# Altium project JLB_PCB.PrjPcb (part 2 of 2)

## Sheet Display.SchDoc
size A3; SheetNumber: 16; SheetTotal: 18
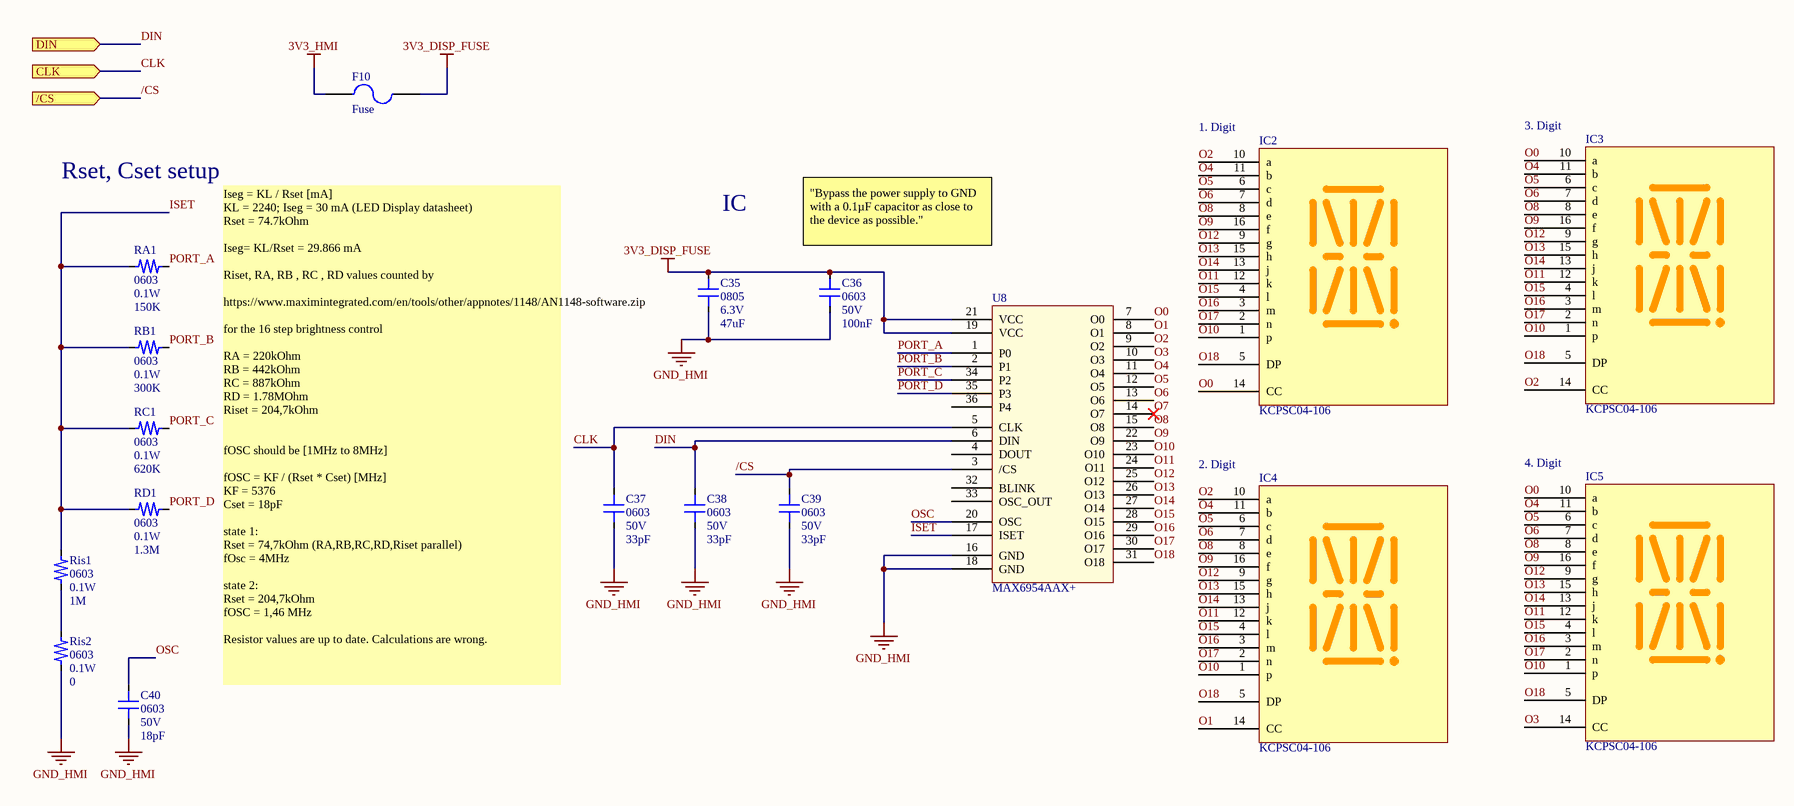
[diagram p15: Display.SchDoc]

### Parts
C35  0805  value 47uF  Rating: 6.3V  [C_0805]
C36  0603  value 100nF  Rating: 50V  [C_0603]
C37  0603  value 33pF  Rating: 50V  [C_0603]
C38  0603  value 33pF  Rating: 50V  [C_0603]
C39  0603  value 33pF  Rating: 50V  [C_0603]
C40  0603  value 18pF  Rating: 50V  [C_0603]
F10  Fuse  [F_0603]
IC2  KCPSC04-106  [KCPSC04-106]
IC3  KCPSC04-106  [KCPSC04-106]
IC4  KCPSC04-106  [KCPSC04-106]
IC5  KCPSC04-106  [KCPSC04-106]
RA1  0603  value 150K  Rating: 0.1W  [R_0603]
RB1  0603  value 300K  Rating: 0.1W  [R_0603]
RC1  0603  value 620K  Rating: 0.1W  [R_0603]
RD1  0603  value 1.3M  Rating: 0.1W  [R_0603]
Ris1  0603  value 1M  Rating: 0.1W  [R_0603]
Ris2  0603  value 0  Rating: 0.1W  [R_0603]
U8  MAX6954AAX+  [TSSOP-36]

### Ports
/CS (in), CLK (in), DIN (in)

### Nets
3V3_DISP_FUSE: C35.2(C2) C36.2(C2) F10.2 U8.19(VCC) U8.21(VCC)
3V3_HMI: F10.1
GND_HMI: C35.1(C1) C36.1(C1) C37.1(C1) C38.1(C1) C39.1(C1) C40.1(C1) Ris2.1(R1) U8.16(GND) U8.18(GND)
/CS: C39.2(C2) U8.3(/CS) ; port /CS
CLK: C37.2(C2) U8.5(CLK) ; port CLK
DIN: C38.2(C2) U8.6(DIN) ; port DIN
ISET: RA1.2(R2) RB1.2(R2) RC1.2(R2) RD1.2(R2) Ris1.2(R2) U8.17(ISET)
O0: IC2.14(CC) IC3.10(a) IC5.10(a) U8.7(O0)
O1: IC4.14(CC) U8.8(O1)
O2: IC2.10(a) IC3.14(CC) IC4.10(a) U8.9(O2)
O3: IC5.14(CC) U8.10(O3)
O4: IC2.11(b) IC3.11(b) IC4.11(b) IC5.11(b) U8.11(O4)
O5: IC2.6(c) IC3.6(c) IC4.6(c) IC5.6(c) U8.12(O5)
O6: IC2.7(d) IC3.7(d) IC4.7(d) IC5.7(d) U8.13(O6)
O7: U8.14(O7)
O8: IC2.8(e) IC3.8(e) IC4.8(e) IC5.8(e) U8.15(O8)
O9: IC2.16(f) IC3.16(f) IC4.16(f) IC5.16(f) U8.22(O9)
O10: IC2.1(p) IC3.1(p) IC4.1(p) IC5.1(p) U8.23(O10)
O11: IC2.12(k) IC3.12(k) IC4.12(k) IC5.12(k) U8.24(O11)
O12: IC2.9(g) IC3.9(g) IC4.9(g) IC5.9(g) U8.25(O12)
O13: IC2.15(h) IC3.15(h) IC4.15(h) IC5.15(h) U8.26(O13)
O14: IC2.13(j) IC3.13(j) IC4.13(j) IC5.13(j) U8.27(O14)
O15: IC2.4(l) IC3.4(l) IC4.4(l) IC5.4(l) U8.28(O15)
O16: IC2.3(m) IC3.3(m) IC4.3(m) IC5.3(m) U8.29(O16)
O17: IC2.2(n) IC3.2(n) IC4.2(n) IC5.2(n) U8.30(O17)
O18: IC2.5(DP) IC3.5(DP) IC4.5(DP) IC5.5(DP) U8.31(O18)
OSC: C40.2(C2) U8.20(OSC)
PORT_A: RA1.1(R1) U8.1(P0)
PORT_B: RB1.1(R1) U8.2(P1)
PORT_C: RC1.1(R1) U8.34(P2)
PORT_D: RD1.1(R1) U8.35(P3)
NetRis1_1: Ris1.1(R1) Ris2.2(R2)

Not connected (* = marked no-connect by the designer): U8 4(DOUT) 32(BLINK) 33(OSC_OUT) 36(P4)

### Notes on the sheet
- (near IC2) 1. Digit
- (near IC3) 3. Digit
- Rset, Cset setup
- IC
- (near C36) "Bypass the power supply to GND with a 0.1µF capacitor as close to the device as possible."
- (near IC4) 2. Digit
- (near IC5) 4. Digit
- Iseg = KL / Rset [mA]
  KL = 2240; Iseg = 30 mA (LED Display datasheet)
  Rset = 74.7kOhm
  Iseg= KL/Rset = 29.866 mA
  Riset, RA, RB , RC , RD values counted by
  https://www.maximintegrated.com/en/tools/other/appnotes/1148/AN1148-software.zip
  for the 16 step brightness control
  RA = 220kOhm
  RB = 442kOhm
  RC = 887kOhm
  RD = 1.78MOhm
  Riset = 204,7kOhm
  fOSC should be [1MHz to 8MHz]
  fOSC = KF / (Rset * Cset) [MHz]
  KF = 5376
  Cset = 18pF
  state 1:
  Rset = 74,7kOhm (RA,RB,RC,RD,Riset parallel)
  fOsc = 4MHz
  state 2:
  Rset = 204,7kOhm
  fOSC = 1,46 MHz
  Resistor values are up to date. Calculations are wrong.

### Library data of the parts
C35 = Cap_0805_47uF_6.3V_Chip: Part Number: CL21A476MQYNNNE; Type: Chip Capacitor; Tolerance: 20%; Order Number: 82-08-66; Distributor: Lomex; Link: http://lomex.hu/hu/webshop/#/page,0/search,82-08-66/stype,1/sidx,1; Price (HUF): 2.00; Package: 0805; ID: Cap_0805_47uF_6.3V_Chip; NI Part Number: -; NI PEN/DEB: -
C36 = Cap_0603_100nF_50V_Chip: Part Number: CC0603KRX7R9BB104; NI Part Number: 716340-01; Type: Chip Capacitor; Tolerance: 10%; NI PEN/DEB: DEB; Order Number: 82-06-23; Distributor: Lomex; Link: http://lomex.hu/hu/webshop/#/page,0/search,82-06-23/stype,1/sidx,1; Price (HUF): 2.00; Package: 0603; ID: Cap_0603_100nF_50V_Chip
C37-C39 = Cap_0603_33pF_50V_Chip: Part Number: CL10C330JB8NNNC; NI Part Number: 715511-01; Type: Chip Capacitor; Tolerance: 5%; NI PEN/DEB: DEB; Order Number: 82-09-74; Distributor: Lomex; Link: http://lomex.hu/hu/webshop/#/page,0/search,82-09-74/stype,1/sidx,1; Price (HUF): 2.00; Package: 0603; ID: Cap_0603_33pF_50V_Chip
C40 = Cap_0603_18pF_50V_Chip: Part Number: CL10C180JB8NNNC; NI Part Number: 715742-01; Type: Chip Capacitor; Tolerance: 5%; NI PEN/DEB: DEB; Order Number: 82-06-54; Distributor: Lomex; Link: http://lomex.hu/hu/webshop/#/page,0/search,82-06-54/stype,1/sidx,1; Price (HUF): 2.00; Package: 0603; ID: Cap_0603_18pF_50V_Chip
F10 = Oth_0438001.WR_F_0603: NI part number: 766308-01; Order number: 2413034; Rating: 32VDC; Type: Very Fast Acting Fuse; Value: 1A; NI PEN/DEB: DEB; Distributor: Farnell; ID: Oth_0438001.WR_F_0603; Link: http://hu.farnell.com/littelfuse/0438001-wr/fuse-smd-1a-0603-fast-acting-full/dp/2413034?ost=0438001.WR&selectedCategoryId=&categoryNameResp=%25C3%2596sszes%2Bkateg%25C3%25B3ria&searchView=table&iscrfnonsku=false; Package: F_0603; Part Number: 0438001.WR; Price (HUF): 142
IC2-IC5 = 14SegmentDisplaySingle: Distributor: Farnell; Link: http://hu.farnell.com/kingbright/kcpsc04-106/led-alpha-num-10-16mm-orange/dp/2449716; Type: 14SegmentDisplaySingle
RA1 RB1 RC1 RD1 = Res_0603_220K_0.1W_Chip: Part Number: CR-03FL7--220K; NI part number: 612705-01; Tolerance: 1%; NI PEN/DEB: DEB; Type: Chip Resistor; Order Number: 80-11-75; Distributor: Lomex; Price (HUF): 0.80; Package: 0603; ID: Res_0603_220K_0.1W_Chip
  RA1: Link: http://lomex.hu/hu/webshop/#/page,0/search,80-11-75/stype,1/sidx,1
  RB1: Link: http://lomex.hu/hu/webshop/#/search,80-45-26/stype,1
  RC1: Link: http://lomex.hu/hu/webshop/#/search,80-45-61/stype,1
  RD1: Link: http://lomex.hu/hu/webshop/#/search,80-49-35/stype,1
Ris1 = Res_0603_4K70_0.1W_Chip: Part Number: CR-03FL7---4K7; NI part number: 713782-01; Tolerance: 1%; NI PEN/DEB: PEN; Type: Chip Resistor; Order Number: 80-11-85; Distributor: Lomex; Link: http://lomex.hu/hu/webshop/#/page,0/search,80-11-85/stype,1/sidx,1; Price (HUF): 0.80; Package: 0603; ID: Res_0603_4K70_0.1W_Chip
Ris2 = Res_0603_200K_0.1W_Chip: Part Number: CR-03FL7--200K; NI part number: 713614-01; Tolerance: 1%; NI PEN/DEB: PEN; Type: Chip Resistor; Order Number: 80-13-51; Distributor: Lomex; Link: http://lomex.hu/hu/webshop/#/page,0/search,80-13-51/stype,1/sidx,1; Price (HUF): 0.80; Package: 0603; ID: Res_0603_200K_0.1W_Chip
U8 = IC_MAX6954AAX+_TSSOP-36: 16 Segment LED Driver; Order number: 2113136; Distributor: Farnell; Link: http://hu.farnell.com/maxim-integrated-products/max6954aax/driver-led-16x7seg-8x16seg-128/dp/2113136; Value: *; ID: IC_MAX6954AAX+_TSSOP-36; Note: MAX6954; Package: TSSOP-36; Part Number: MAX6954AAX+; Price (HUF): 7470; Type: 16 Segment LED Driver; NI part number: -; NI PEN/DEB: -

## Sheet Measurements.SchDoc
size A4; SheetNumber: 17; SheetTotal: 18
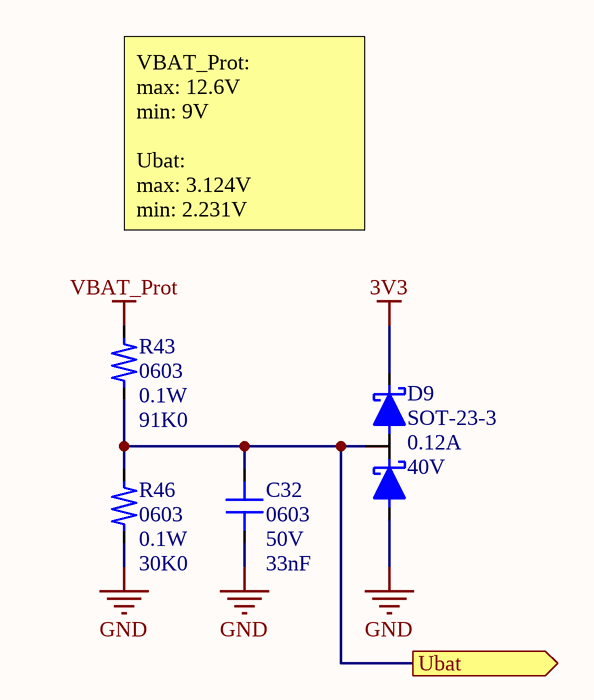
[diagram p16: Measurements.SchDoc]

### Parts
C32  0603  value 33nF  Rating: 50V  [C_0603]
D9  SOT-23-3  value 40V  Rating: 0.12A  [SOT-23-3]
R43  0603  value 91K0  Rating: 0.1W  [R_0603]
R46  0603  value 30K0  Rating: 0.1W  [R_0603]

### Ports
Ubat (out)

### Nets
3V3: D9.2(DC)
GND: C32.1(C1) D9.1(DA) R46.1(R1)
VBAT_Prot: R43.2(R2)
LV_BATT: C32.2(C2) D9.3(DCA) R43.1(R1) R46.2(R2) ; port Ubat

### Notes on the sheet
- VBAT_Prot:
  max: 12.6V
  min: 9V
  Ubat:
  max: 3.124V
  min: 2.231V

### Library data of the parts
C32 = CL10B333KB8NNNC: NI Part Number: 716045-01; Type: Chip Capacitor; Tolerance: 10%; ID: Cap_0603_33nF_50V_Chip; NI PEN/DEB: DEB; Part Number: CL10B333KB8NNNC; Order Number: 82-09-36; Distributor: Lomex; Link: http://lomex.hu/hu/webshop/#/page,0/search,82-09-36/stype,1/sidx,1; Price (HUF): 2.00; Package: 0603
D9 = Dio_SOT-23-3_40V_0.12A_Schottky_Series: Part Number: BAS40-04; Type: Schottky Dual Diode; Distributor: Lomex; Link: http://lomex.hu/hu/webshop/#/page,0/search,83-02-49/stype,1/sidx,1; Order Number: 83-02-49; Package: SOT-23-3; Price (HUF): 8; ID: Dio_SOT-23-3_40V_0.12A_Schottky_Series; NI part number: -; NI PEN/DEB: -
R43 = CR-03FL7---91K: NI part number: 612775-01; Tolerance: 1%; Note: NI: 90.9k; ID: Res_0603_91K0_0.1W_Chip; NI PEN/DEB: PEN; Type: Chip Resistor; Part Number: CR-03FL7---91K; Order Number: 80-14-58; Distributor: Lomex; Link: http://lomex.hu/hu/webshop/#/page,0/search,80-14-58/stype,1/sidx,1; Price (HUF): 0.80; Package: 0603
R46 = CR-03FL7---30K: NI part number: 612699-01; Tolerance: 1%; Note: NI: not in stock; ID: Res_0603_30K0_0.1W_Chip; NI PEN/DEB: DEB; Type: Chip Resistor; Part Number: CR-03FL7---30K; Order Number: 80-14-53; Distributor: Lomex; Link: http://lomex.hu/hu/webshop/#/page,0/search,80-14-53/stype,1/sidx,1; Price (HUF): 0.80; Package: 0603

## Sheet Enable_Signals.SchDoc
size A4; SheetNumber: 18; SheetTotal: 18
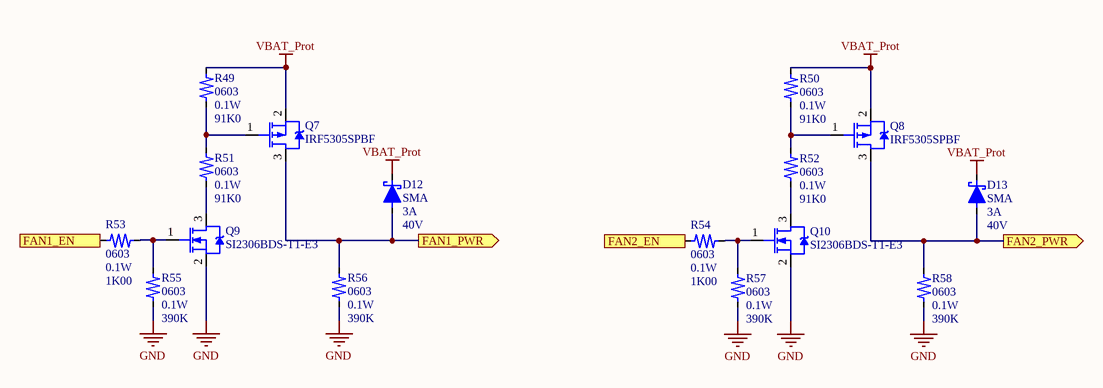
[diagram p17: Enable_Signals.SchDoc]

### Parts
D12  SMA  value 40V  Rating: 3A  [SMA]
D13  SMA  value 40V  Rating: 3A  [SMA]
Q7  IRF5305SPBF  [D2PAK-2]
Q8  IRF5305SPBF  [D2PAK-2]
Q9  SI2306BDS-T1-E3  [SOT-23-3]
Q10  SI2306BDS-T1-E3  [SOT-23-3]
R49  0603  value 91K0  Rating: 0.1W  [R_0603]
R50  0603  value 91K0  Rating: 0.1W  [R_0603]
R51  0603  value 91K0  Rating: 0.1W  [R_0603]
R52  0603  value 91K0  Rating: 0.1W  [R_0603]
R53  0603  value 1K00  Rating: 0.1W  [R_0603]
R54  0603  value 1K00  Rating: 0.1W  [R_0603]
R55  0603  value 390K  Rating: 0.1W  [R_0603]
R56  0603  value 390K  Rating: 0.1W  [R_0603]
R57  0603  value 390K  Rating: 0.1W  [R_0603]
R58  0603  value 390K  Rating: 0.1W  [R_0603]

### Ports
FAN1_EN (in), FAN1_PWR (out), FAN2_EN (in), FAN2_PWR (out)

### Nets
GND: Q9.2(S) Q10.2(S) R55.1(R1) R56.1(R1) R57.1(R1) R58.1(R1)
VBAT_Prot: D12.1(DC) D13.1(DC) Q7.2(S) Q8.2(S) R49.2(R2) R50.2(R2)
FAN1: R53.1(R1) ; port FAN1_EN
FAN1_PWR: D12.2(DA) Q7.3(D) R56.2(R2) ; port FAN1_PWR
FAN2: R54.1(R1) ; port FAN2_EN
FAN2_PWR: D13.2(DA) Q8.3(D) R58.2(R2) ; port FAN2_PWR
NetQ7_1: Q7.1(G) R49.1(R1) R51.2(R2)
NetQ8_1: Q8.1(G) R50.1(R1) R52.2(R2)
NetQ9_1: Q9.1(G) R53.2(R2) R55.2(R2)
NetQ9_3: Q9.3(D) R51.1(R1)
NetQ10_1: Q10.1(G) R54.2(R2) R57.2(R2)
NetQ10_3: Q10.3(D) R52.1(R1)

### Library data of the parts
D12 D13 = SS34A: Part Number: SS34A; Type: Schottky Diode; ID: Dio_SMA_40V_3A_Schottky; Distributor: Lomex; Link: http://lomex.hu/hu/webshop/#/page,0/search,83-02-56/stype,1/sidx,1; Order Number: 83-02-56; Package: SMA; Price (HUF): 19; NI part number: -; NI PEN/DEB: -
Q7 Q8 = IRF5305SPBF: P-Channel Power MOSFET; ID: Tra_D2PAK-2_55V_31A_P-FET; Rating: 31A; Type: P-FET; Value: 55V; Distributor: Lomex; Link: http://lomex.hu/hu/webshop/#/page,0/stype,1/sidx,10/instock,0/search,86-02-47; Order number: 86-02-47; Package: D2PAK-2; Part Number: IRF5305SPBF; Price (HUF): 230; NI part number: -; NI PEN/DEB: -
Q9 Q10 = SI2306BDS-T1-E3: N-Channel Power MOSFET; ID: Tra_SOT-23-3_30V_4A_N-FET; Rating: 4A; Type: N-FET; Value: 30V; Distributor: Lomex; Link: http://lomex.hu/hu/webshop/#/page,0/stype,1/sidx,10/instock,0/search,86-01-57; Order number: 86-01-57; Package: SOT-23-3; Part Number: SI2306BDS-T1-E3; Price (HUF): 83; NI part number: -; NI PEN/DEB: -
R49-R52 = CR-03FL7---91K: as R43 on sheet Measurements; Type: Chip Resistor; Part Number: CR-03FL7---91K; Order Number: 80-14-58; Distributor: Lomex; Link: http://lomex.hu/hu/webshop/#/page,0/search,80-14-58/stype,1/sidx,1; Price (HUF): 0.80; Package: 0603
R53 R54 = CR-03FL7----1K: NI part number: 713776-01; Tolerance: 1%; ID: Res_0603_1K00_0.1W_Chip; NI PEN/DEB: DEB; Type: Chip Resistor; Part Number: CR-03FL7----1K; Order Number: 80-11-59; Distributor: Lomex; Link: http://lomex.hu/hu/webshop/#/page,0/search,80-11-59/stype,1/sidx,1; Price (HUF): 0.80; Package: 0603
R55-R58 = CR-03FL7--390K: Tolerance: 1%; ID: Res_0603_390K_0.1W_Chip; Type: Chip Resistor; Part Number: CR-03FL7--390K; Order Number: 80-13-26; Distributor: Lomex; Link: http://lomex.hu/hu/webshop/#/page,0/search,80-13-26/stype,1/sidx,1; Price (HUF): 0.80; Package: 0603; NI part number: -; NI PEN/DEB: -

## Nets that join several sheets
3V3: MainSheet (J16.10), 3V3_Supply (F4.2), IMU (F5.1), Telemetry_Modul (F6.1), Measurements (D9.2)
3V3_HMI: HMI (J17.10), HMI_LEDs (5 pins), HMI_Buttons (8 pins), Display (F10.1)
5V: MainSheet (10 pins), MCU (F1.1), 5V_Supply (D3.1 F3.2), 3V3_Supply (C9.2 C10.2 IC1.3), Radio_module (F7.1)
8V4_F: MainSheet (J3.1), Front_Servo_Supply (D5.1 F8.2)
8V4_R: MainSheet (J6.1), Rear_Servo_Supply (D7.1 F9.2)
GND: MainSheet (22 pins), MCU (15 pins), Supply_Protection (D2.2 R1.1), 5V_Supply (13 pins), 3V3_Supply (5 pins), Front_Servo_Supply (13 pins), Rear_Servo_Supply (13 pins), IMU (U3.13), Telemetry_Modul (U4.10), Radio_module (U5.1), Measurements (C32.1 D9.1 R46.1), Enable_Signals (6 pins)
GND_HMI: HMI (J17.1), HMI_LEDs (10 pins), HMI_Buttons (10 pins), Display (9 pins)
VBAT: MainSheet (J4.1), Supply_Protection (SW1.1)
VBAT_Prot: Supply_Protection (D2.1 F2.2), 5V_Supply (5 pins), Front_Servo_Supply (5 pins), Rear_Servo_Supply (5 pins), Measurements (R43.2), Enable_Signals (6 pins)
ILEF: MainSheet (J8.9), MCU (U1.57)
ILER: MainSheet (J9.9), MCU (U1.63)
/CS: HMI (J17.8), Display (C39.2 U8.3)
AD_MISO: MainSheet (J8.4 J9.4), MCU (U1.85)
AD_MOSI: MainSheet (J8.3 J9.3), MCU (U1.125)
AD_SCK: MainSheet (J8.13 J9.13), MCU (U1.83)
ADCF1: MainSheet (J8.14), MCU (U1.82)
ADCF2: MainSheet (J8.15), MCU (U1.69)
ADCF3: MainSheet (J8.1), MCU (U1.137)
ADCF4: MainSheet (J8.2), MCU (U1.117)
ADCR1: MainSheet (J9.14), MCU (U1.115)
ADCR2: MainSheet (J9.15), MCU (U1.113)
ADCR3: MainSheet (J9.1), MCU (U1.118)
ADCR4: MainSheet (J9.2), MCU (U1.120)
AIN1: MainSheet (J10.2), MCU (U1.109)
AIN2: MainSheet (J13.2), MCU (U1.107)
AIN3: MainSheet (J11.2), MCU (U1.32)
AIN4: MainSheet (J14.2), MCU (U1.96)
BATT: MainSheet (J12.5), MCU (U1.38)
BUTTON1: MainSheet (J16.11), MCU (U1.136)
BUTTON2: MainSheet (J16.12), MCU (U1.124)
BUTTON3: MainSheet (J16.13), MCU (U1.141)
BUTTON4: MainSheet (J16.14), MCU (U1.140)
CH_A: MainSheet (J15.3), MCU (U1.47)
CH_B: MainSheet (J15.2), MCU (U1.48)
CLK: HMI (J17.9), Display (C37.2 U8.5)
CURR: MainSheet (J12.6), MCU (U1.36)
D_/CS: MainSheet (J16.8), MCU (U1.94)
D_CLK: MainSheet (J16.9), MCU (U1.1)
D_DIN: MainSheet (J16.7), MCU (U1.3)
DIN: HMI (J17.7), Display (C38.2 U8.6)
DRIVE_EN: MainSheet (J12.1), MCU (U1.130)
F_INF_/OE: MainSheet (J8.10), MCU (U1.4)
F_LED_/OE: MainSheet (J8.17), MCU (U1.45)
F_LED_LE: MainSheet (J8.7), MCU (U1.55)
FAN1: MCU (U1.134), Enable_Signals (R53.1)
FAN1_PWR: MainSheet (J1.1), Enable_Signals (D12.2 Q7.3 R56.2)
FAN2: MCU (U1.131), Enable_Signals (R54.1)
FAN2_PWR: MainSheet (J2.1), Enable_Signals (D13.2 Q8.3 R58.2)
FB: MainSheet (J12.4), MCU (U1.108)
INF/LED_MOSI: MainSheet (J8.18 J9.18), MCU (U1.40)
INF/LED_SCK: MainSheet (J8.8 J9.8), MCU (U1.97)
IOER: MainSheet (J9.10), MCU (U1.65)
LED1: MainSheet (J16.2), MCU (U1.133)
LED2: MainSheet (J16.3), MCU (U1.142)
LED3: MainSheet (J16.4), MCU (U1.122)
LED4: MainSheet (J16.5), MCU (U1.132)
LED5: MainSheet (J16.6), MCU (U1.129)
LV_BATT: MCU (U1.87), Measurements (C32.2 D9.3 R43.1 R46.2)
M_PWM1: MainSheet (J12.2), MCU (U1.9)
M_PWM2: MainSheet (J12.3), MCU (U1.56)
NetC12_2: HMI (J17.11), HMI_Buttons (C12.2 R25.2 S1.2)
NetC13_2: HMI (J17.12), HMI_Buttons (C13.2 R26.2 S2.2)
NetC14_2: HMI (J17.13), HMI_Buttons (C14.2 R31.2 S3.2)
NetC15_2: HMI (J17.14), HMI_Buttons (C15.2 R32.2 S4.2)
NetJ17_2: HMI (J17.2), HMI_LEDs (R13.1)
NetJ17_3: HMI (J17.3), HMI_LEDs (R14.1)
NetJ17_4: HMI (J17.4), HMI_LEDs (R15.1)
NetJ17_5: HMI (J17.5), HMI_LEDs (R21.1)
NetJ17_6: HMI (J17.6), HMI_LEDs (R22.1)
NetJ17_15: HMI (J17.15), HMI_Buttons (R27.1 SW2.1)
NetJ17_16: HMI (J17.16), HMI_Buttons (R28.1 SW2.6)
NetJ17_17: HMI (J17.17), HMI_Buttons (R29.1 SW2.3)
NetJ17_18: HMI (J17.18), HMI_Buttons (R30.1 SW2.4)
R_LED_/OE: MainSheet (J9.17), MCU (U1.68)
R_LED_LE: MainSheet (J9.7), MCU (U1.66)
RADIO_RX: MCU (U1.28), Radio_module (U5.14)
RADIO_TX: MCU (U1.30), Radio_module (U5.12)
RC_PWM_M: MainSheet (J7.3), MCU (U1.105)
RC_PWM_S: MainSheet (J7.2), MCU (U1.123)
ROTARY1: MainSheet (J16.15), MCU (U1.119)
ROTARY2: MainSheet (J16.16), MCU (U1.128)
ROTARY3: MainSheet (J16.17), MCU (U1.121)
ROTARY4: MainSheet (J16.18), MCU (U1.127)
S_PWM_F: MainSheet (J3.2), MCU (U1.95)
SCL: MCU (U1.75), IMU (R9.1 U3.20)
SDA: MCU (U1.77), IMU (R8.1 U3.21)
XBEE_RX: MCU (U1.41), Telemetry_Modul (U4.3)
XBEE_TX: MCU (U1.43), Telemetry_Modul (U4.2)